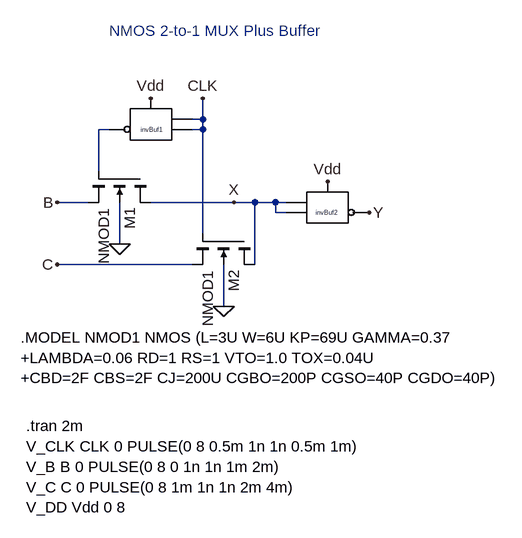
[diagram p0: schematic nmos_2t1_mux.asc]
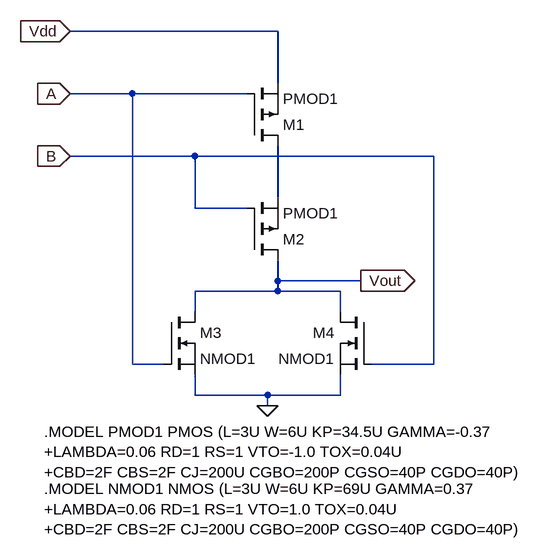
[diagram p1: sub-circuit nor_gate.asc]
nmos_2t1_mux.asc, the LTspice schematic file:
Version 4
SHEET 1 880 748
WIRE 208 144 208 112
WIRE 208 144 192 144
WIRE 64 160 48 160
WIRE 208 160 208 144
WIRE 208 160 192 160
WIRE 48 224 48 160
WIRE 32 272 -16 272
WIRE 256 272 128 272
WIRE 288 272 256 272
WIRE 320 272 288 272
WIRE 336 272 320 272
WIRE 320 288 320 272
WIRE 336 288 320 288
WIRE 208 320 208 160
WIRE 80 336 80 272
WIRE 192 368 -16 368
WIRE 288 368 288 272
WIRE 240 432 240 368
FLAG 208 112 CLK
FLAG -16 272 B
FLAG -16 368 C
FLAG 80 336 0
FLAG 240 432 0
FLAG 128 112 Vdd
FLAG 400 240 Vdd
FLAG 464 288 Y
FLAG 256 272 X
SYMBOL nor_gate 128 160 M0
SYMATTR InstName invBuf1
SYMBOL nmos4 128 224 R90
SYMATTR InstName M1
SYMATTR Value NMOD1
SYMBOL nmos4 288 320 R90
SYMATTR InstName M2
SYMATTR Value NMOD1
SYMBOL nor_gate 400 288 R0
SYMATTR InstName invBuf2
TEXT 64 8 Left 2 ;NMOS 2-to-1 MUX Plus Buffer
TEXT -72 480 Left 2 !.MODEL NMOD1 NMOS (L=3U W=6U KP=69U GAMMA=0.37\n+LAMBDA=0.06 RD=1 RS=1 VTO=1.0 TOX=0.04U\n+CBD=2F CBS=2F CJ=200U CGBO=200P CGSO=40P CGDO=40P)
TEXT -64 648 Left 2 !V_CLK CLK 0 PULSE(0 8 0.5m 1n 1n 0.5m 1m)\nV_B B 0 PULSE(0 8 0 1n 1n 1m 2m)\nV_C C 0 PULSE(0 8 1m 1n 1n 2m 4m)\nV_DD Vdd 0 8
TEXT -64 616 Left 2 !.tran 2m

nor_gate.asc, the sub-circuit schematic file:
Version 4
SHEET 1 880 712
WIRE 192 -64 -128 -64
WIRE 192 16 192 -64
WIRE -32 32 -128 32
WIRE 144 32 -32 32
WIRE 64 128 -128 128
WIRE 432 128 64 128
WIRE 192 192 192 112
WIRE 64 208 64 128
WIRE 144 208 64 208
WIRE 192 320 192 288
WIRE 320 320 192 320
WIRE 192 336 192 320
WIRE 192 336 64 336
WIRE 288 336 192 336
WIRE 64 368 64 336
WIRE 288 368 288 336
WIRE -32 448 -32 32
WIRE 16 448 -32 448
WIRE 432 448 432 128
WIRE 432 448 336 448
WIRE 64 496 64 464
WIRE 176 496 64 496
WIRE 288 496 288 464
WIRE 288 496 176 496
WIRE 176 512 176 496
FLAG -128 32 A
IOPIN -128 32 In
FLAG -128 128 B
IOPIN -128 128 In
FLAG -128 -64 Vdd
IOPIN -128 -64 In
FLAG 320 320 Vout
IOPIN 320 320 Out
FLAG 176 512 0
SYMBOL pmos 144 112 M180
SYMATTR InstName M1
SYMATTR Value PMOD1
SYMBOL pmos 144 288 M180
SYMATTR InstName M2
SYMATTR Value PMOD1
SYMBOL nmos 16 368 R0
SYMATTR InstName M3
SYMATTR Value NMOD1
SYMBOL nmos 336 368 M0
SYMATTR InstName M4
SYMATTR Value NMOD1
TEXT -168 552 Left 2 !.MODEL PMOD1 PMOS (L=3U W=6U KP=34.5U GAMMA=-0.37\n+LAMBDA=0.06 RD=1 RS=1 VTO=-1.0 TOX=0.04U\n+CBD=2F CBS=2F CJ=200U CGBO=200P CGSO=40P CGDO=40P)
TEXT -168 640 Left 2 !.MODEL NMOD1 NMOS (L=3U W=6U KP=69U GAMMA=0.37\n+LAMBDA=0.06 RD=1 RS=1 VTO=1.0 TOX=0.04U\n+CBD=2F CBS=2F CJ=200U CGBO=200P CGSO=40P CGDO=40P)

The netlist it stands for:
* nmos_2t1_mux.asc
XinvBuf1 CLK CLK N001 Vdd nor_gate
M1 X N001 B 0 NMOD1
M2 X CLK C 0 NMOD1
XinvBuf2 X X Y Vdd nor_gate

* block symbol definitions
.subckt nor_gate A B Vout Vdd
M1 N001 A Vdd Vdd PMOD1
M2 Vout B N001 N001 PMOD1
M3 Vout A 0 0 NMOD1
M4 Vout B 0 0 NMOD1
.MODEL PMOD1 PMOS (L=3U W=6U KP=34.5U GAMMA=-0.37
+LAMBDA=0.06 RD=1 RS=1 VTO=-1.0 TOX=0.04U
+CBD=2F CBS=2F CJ=200U CGBO=200P CGSO=40P CGDO=40P)
.MODEL NMOD1 NMOS (L=3U W=6U KP=69U GAMMA=0.37
+LAMBDA=0.06 RD=1 RS=1 VTO=1.0 TOX=0.04U
+CBD=2F CBS=2F CJ=200U CGBO=200P CGSO=40P CGDO=40P)
.ends nor_gate

.model NMOS NMOS
.model PMOS PMOS
.lib standard.mos
* NMOS 2-to-1 MUX Plus Buffer
.MODEL NMOD1 NMOS (L=3U W=6U KP=69U GAMMA=0.37
+LAMBDA=0.06 RD=1 RS=1 VTO=1.0 TOX=0.04U
+CBD=2F CBS=2F CJ=200U CGBO=200P CGSO=40P CGDO=40P)
V_CLK CLK 0 PULSE(0 8 0.5m 1n 1n 0.5m 1m)
V_B B 0 PULSE(0 8 0 1n 1n 1m 2m)
V_C C 0 PULSE(0 8 1m 1n 1n 2m 4m)
V_DD Vdd 0 8
.tran 2m
.backanno
.end